# Altium project Audio Board Breakout.PrjPCB
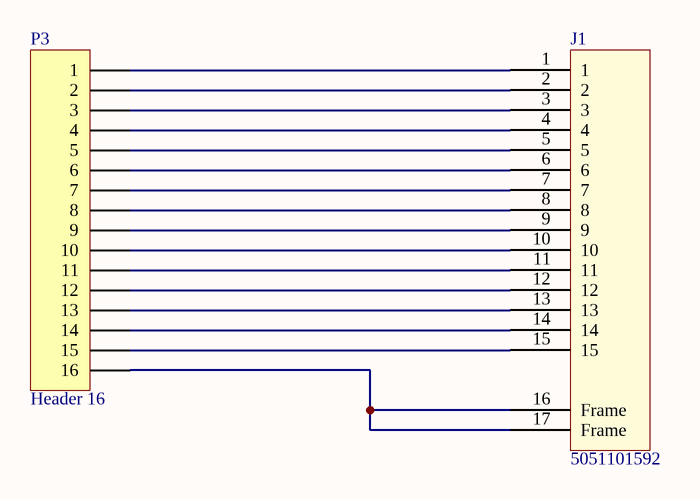
[diagram p0: Audio Board Breakout.SchDoc]
1 sheet, 2 parts. Net scope: global (net labels, ports and power ports of the same name join across sheets).
Board file: Audio Board Breakout.PcbDoc

## Sheet Audio Board Breakout.SchDoc
size B

### Parts
J1  5051101592  [5051101592]
P3  Header 16  [HDR1X16]

### Nets
NetJ1_1: J1.1 P3.1
NetJ1_2: J1.2 P3.2
NetJ1_3: J1.3 P3.3
NetJ1_4: J1.4 P3.4
NetJ1_5: J1.5 P3.5
NetJ1_6: J1.6 P3.6
NetJ1_7: J1.7 P3.7
NetJ1_8: J1.8 P3.8
NetJ1_9: J1.9 P3.9
NetJ1_10: J1.10 P3.10
NetJ1_11: J1.11 P3.11
NetJ1_12: J1.12 P3.12
NetJ1_13: J1.13 P3.13
NetJ1_14: J1.14 P3.14
NetJ1_15: J1.15 P3.15
NetJ1_16: J1.16(Frame) J1.17(Frame) P3.16

### Library data of the parts
P3 = Header 16: Header, 16-Pin; LatestRevisionDate: 17-Jul-2002; LatestRevisionNote: Re-released for DXP Platform.; Publisher: Altium Limited